# Altium schematic sheet Drivers.SchDoc
size A4; PageSetup: Record=PageOptions|CenterHorizontal=True|CenterVertical=True|PrintScale=1.00|XCorrection=1.00|YCorrection=1.00|PrintKind=2|BorderSize=5000000|LeftOffset=0|BottomOffset=0|Orientation=2|PaperLength=1000|PaperWidth=1000|Scale=100|PaperSource=7|PrintQuality=-3|MediaType=1|DitherType=10|PrintScaleMode=1|PaperKind=A4|PaperIndex=9
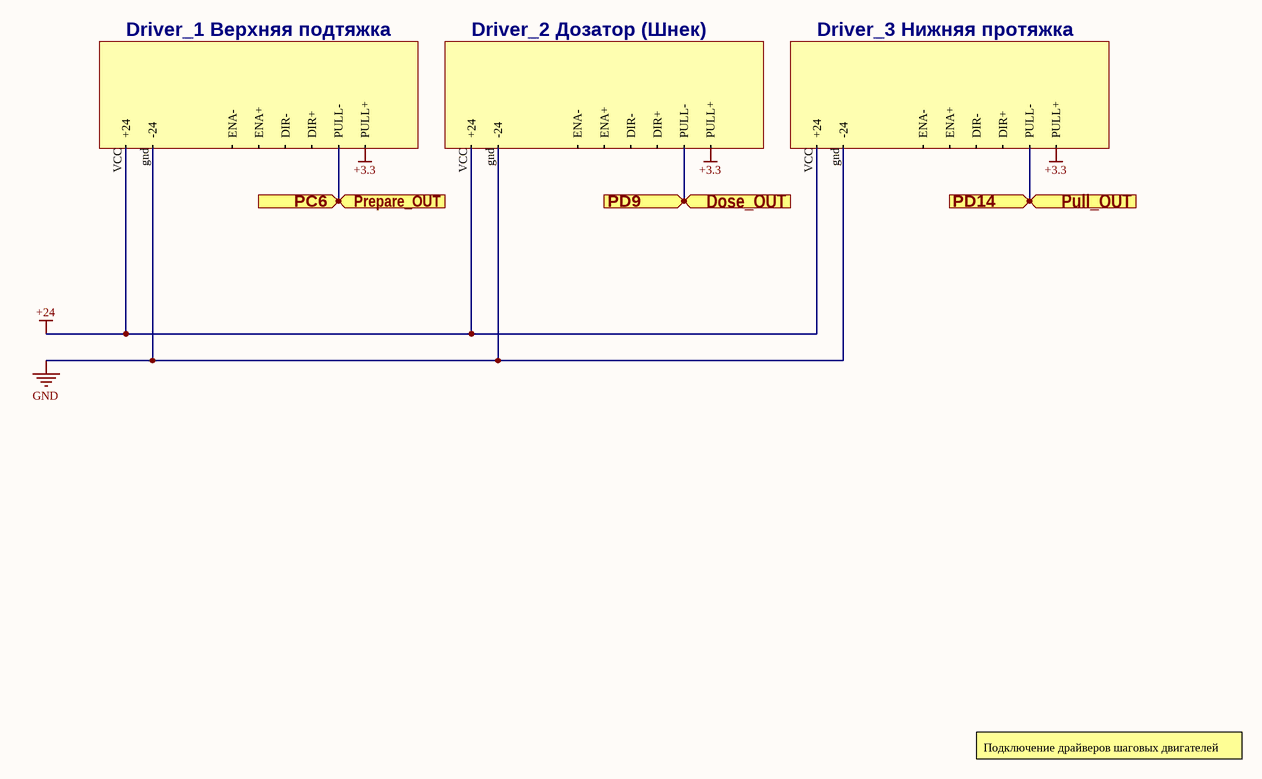
[diagram p0: Drivers.SchDoc]

## Parts
1  Driver_1 Верхняя подтяжка
2  Driver_2 Дозатор (Шнек)
3  Driver_3 Нижняя протяжка

## Ports
Dose_OUT (in), PC6 (in), PD9 (in), PD14 (in), Prepare_OUT (in), Pull_OUT (in)

## Nets
+3.3: 1.?6(PULL+) 2.?6(PULL+) 3.?6(PULL+)
+24: 1.VCC(+24) 2.VCC(+24) 3.VCC(+24)
GND: 1.gnd(-24) 2.gnd(-24) 3.gnd(-24)
Dose_OUT: 2.?5(PULL-) ; port PD9, port Dose_OUT
PC6: 1.?5(PULL-) ; port PC6, port Prepare_OUT
PD14: 3.?5(PULL-) ; port PD14, port Pull_OUT

Not connected (* = marked no-connect by the designer): 1 ?1(ENA-) ?2(ENA+) ?3(DIR-) ?4(DIR+); 2 ?1(ENA-) ?2(ENA+) ?3(DIR-) ?4(DIR+); 3 ?1(ENA-) ?2(ENA+) ?3(DIR-) ?4(DIR+)

## Notes on the sheet
- Подключение драйверов шаговых двигателей

## Library data of the parts
1-3 = Driver